# EAGLE design Test Bench (EAGLE 9.6.2)
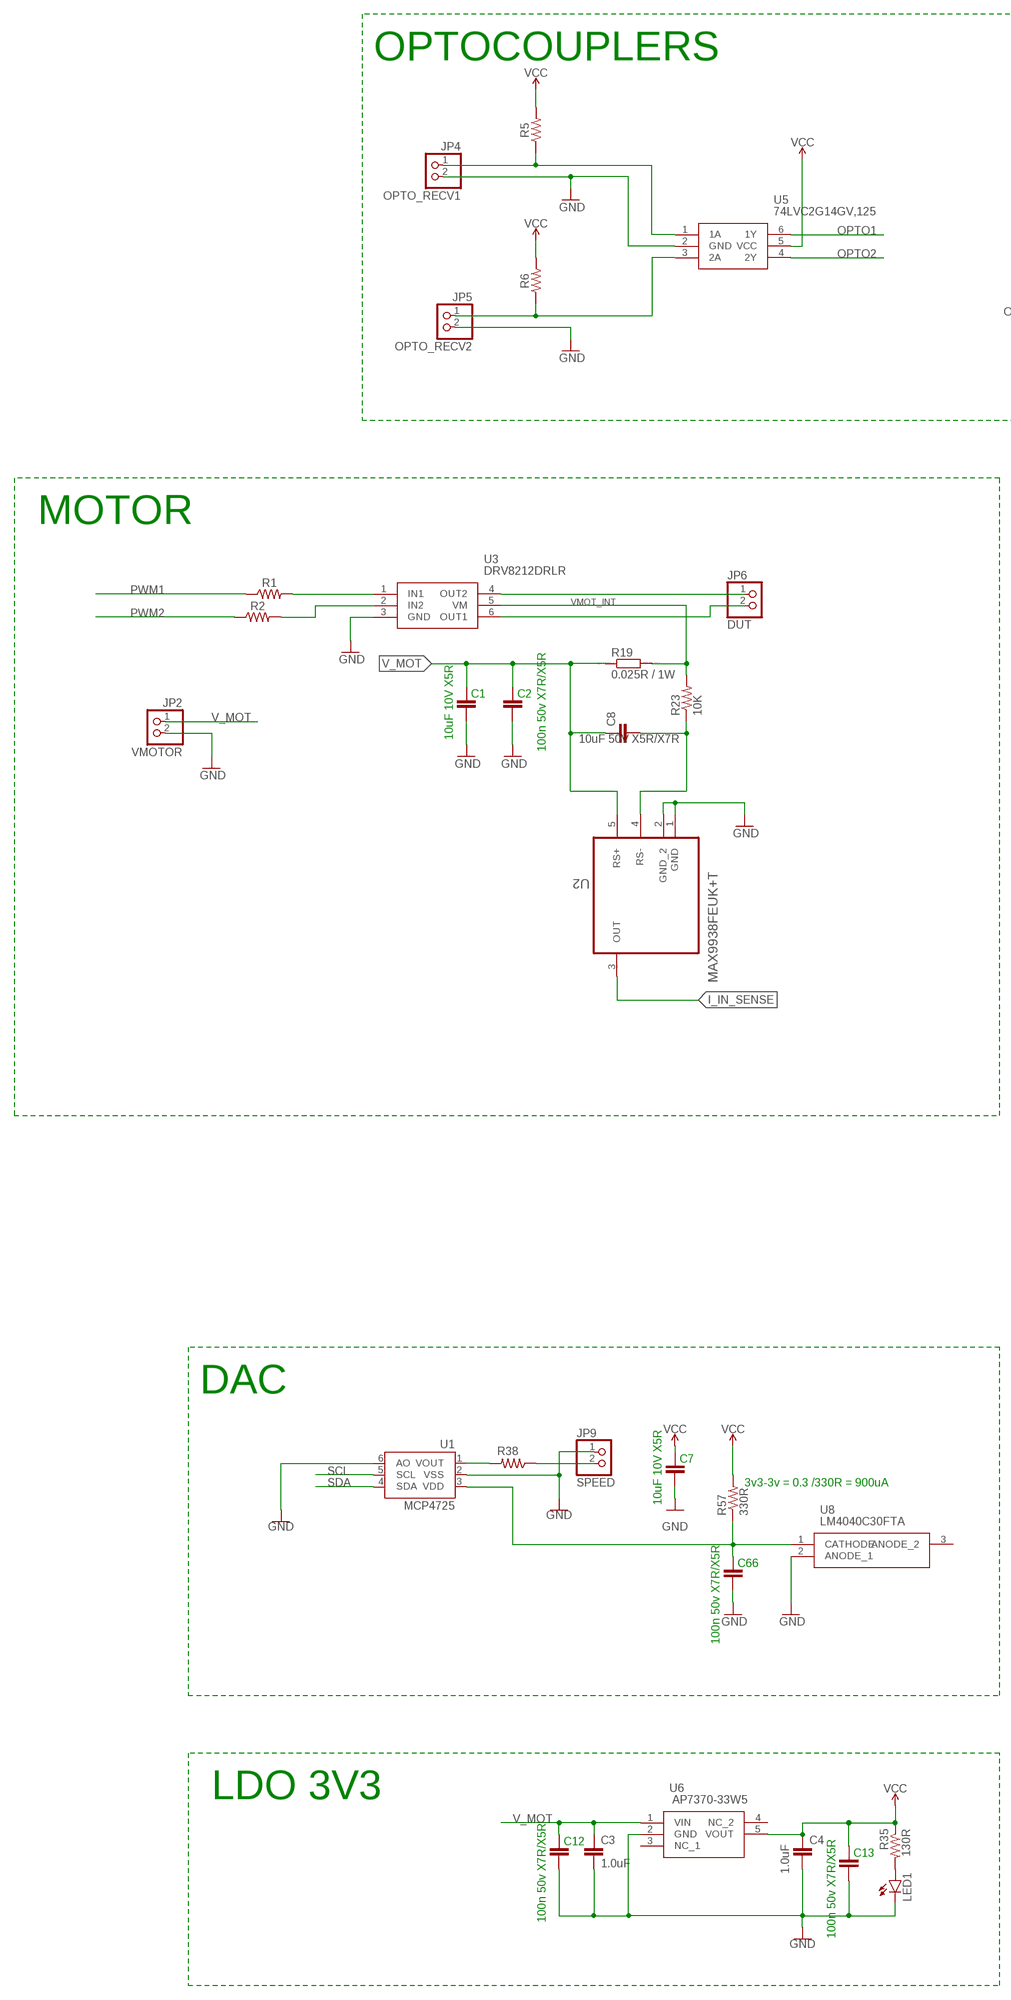
[diagram p0: schematic, sheet 1, part 1 of 2]
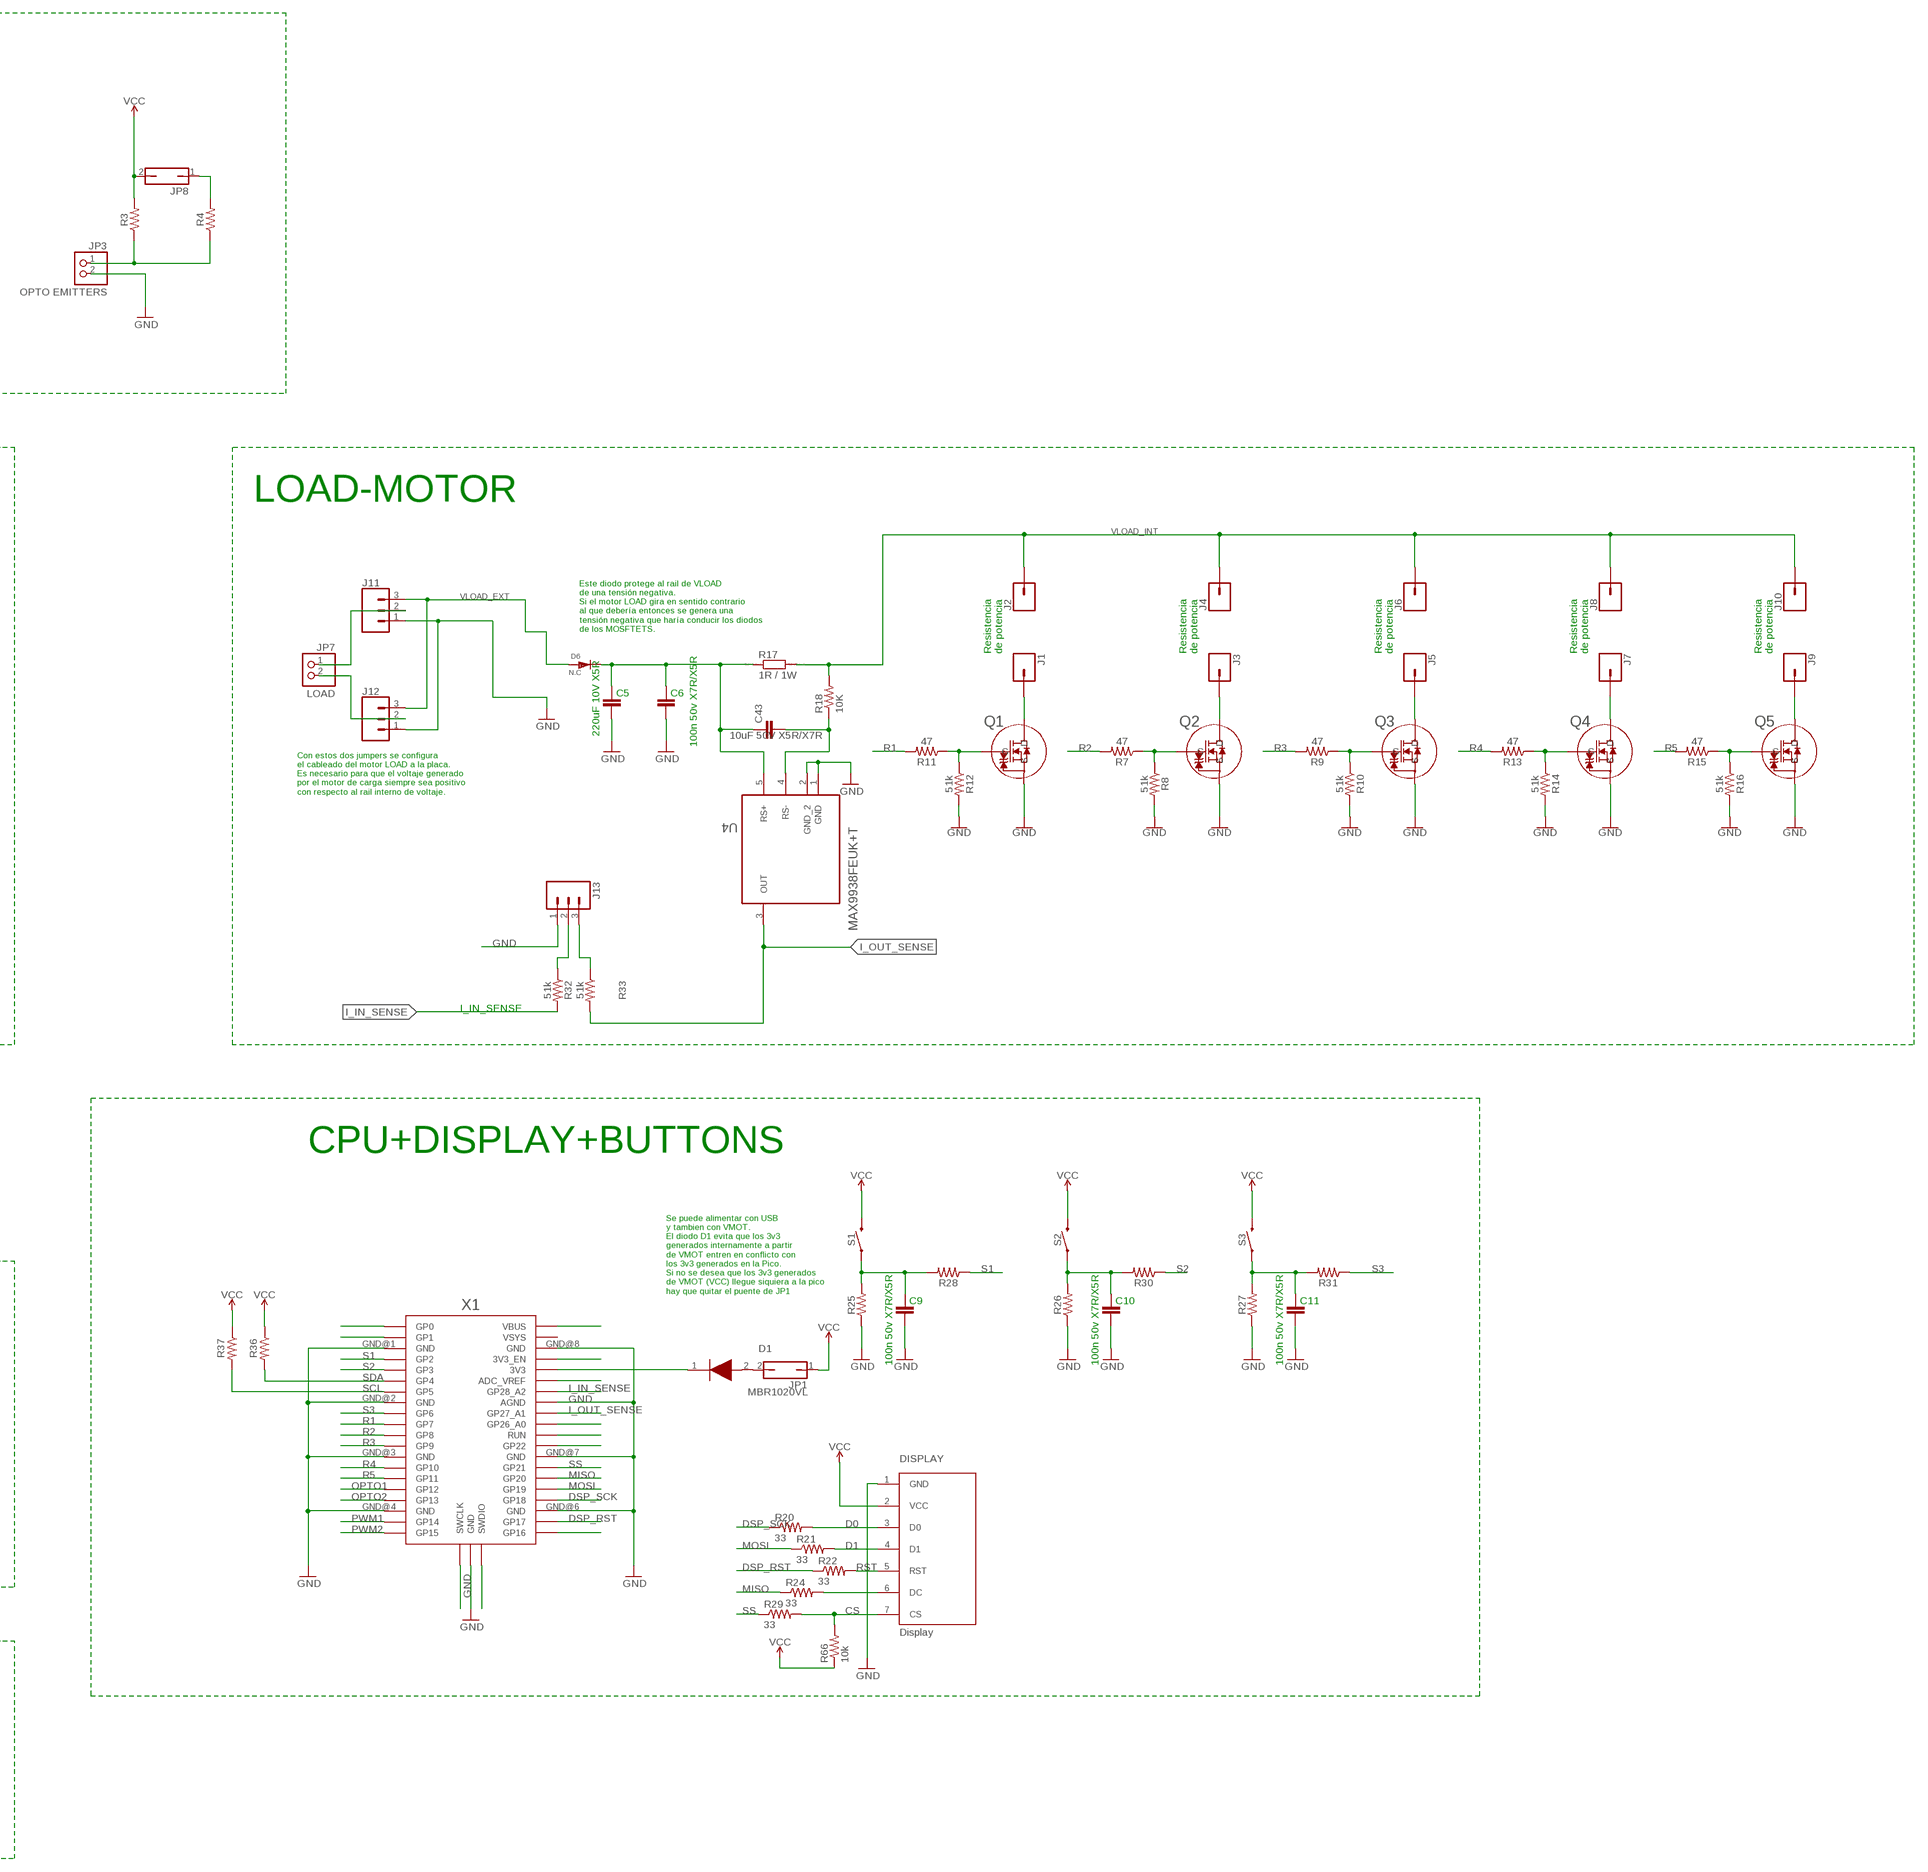
[diagram p1: schematic, sheet 1, part 2 of 2]

## Parts
C1  10uF 10V X5R  CAP0805  [0805]
C2  100n 50v X7R/X5R  CAP0805  [0805]
C3  1.0uF  1.0UF-0805-25V-(+80/-20%)  [0805]
C4  1.0uF  1.0UF-0805-25V-(+80/-20%)  [0805]
C5  220uF 10V X5R  CAP0805  [0805]
C6  100n 50v X7R/X5R  CAP0805  [0805]
C7  10uF 10V X5R  CAP0805  [0805]
C8  10uF 50V X5R/X7R  CAP1206  [1206]
C9  100n 50v X7R/X5R  CAP0805  [0805]
C10  100n 50v X7R/X5R  CAP0805  [0805]
C11  100n 50v X7R/X5R  CAP0805  [0805]
C12  100n 50v X7R/X5R  CAP0805  [0805]
C13  100n 50v X7R/X5R  CAP0805  [0805]
C43  10uF 50V X5R/X7R  CAP1206  [1206]
C66  100n 50v X7R/X5R  CAP0805  [0805]
D1  MBR1020VL  [SODFL3617X108N]
D6  N.C  DSMC  [DO-214AB]
DISPLAY  Display  OLED_LCD  [OLED_LCD]
J1  CONN_01  [1X01]
J2  CONN_01  [1X01]
J3  CONN_01  [1X01]
J4  CONN_01  [1X01]
J5  CONN_01  [1X01]
J6  CONN_01  [1X01]
J7  CONN_01  [1X01]
J8  CONN_01  [1X01]
J9  CONN_01  [1X01]
J10  CONN_01  [1X01]
J11  CONN_03  [1X03]
J12  CONN_03  [1X03]
J13  CONN_03  [1X03]
JP1  JP1Q  [JP1]
JP2  VMOTOR  PINHD-1X2  [1X02]
JP3  OPTO EMITTERS  PINHD-1X2  [1X02]
JP4  OPTO_RECV1  PINHD-1X2  [1X02]
JP5  OPTO_RECV2  PINHD-1X2  [1X02]
JP6  DUT  PINHD-1X2  [1X02]
JP7  LOAD  PINHD-1X2  [1X02]
JP8  JP1Q  [JP1]
JP9  SPEED  PINHD-1X2  [1X02]
LED1  LED3MM  [LED3MM]
Q1  PJA3416AE_R1_00001  [SOT23_PJA3416_PNJ]
Q2  PJA3416AE_R1_00001  [SOT23_PJA3416_PNJ]
Q3  PJA3416AE_R1_00001  [SOT23_PJA3416_PNJ]
Q4  PJA3416AE_R1_00001  [SOT23_PJA3416_PNJ]
Q5  PJA3416AE_R1_00001  [SOT23_PJA3416_PNJ]
R1  RESISTOR0805  [0805]
R2  RESISTOR0805  [0805]
R3  RESISTOR0805  [0805]
R4  RESISTOR0805  [0805]
R5  RESISTOR0805  [0805]
R6  RESISTOR0805  [0805]
R7  47  RESISTOR0805  [0805]
R8  51k  RESISTOR0805  [0805]
R9  47  RESISTOR0805  [0805]
R10  51k  RESISTOR0805  [0805]
R11  47  RESISTOR0805  [0805]
R12  51k  RESISTOR0805  [0805]
R13  47  RESISTOR0805  [0805]
R14  51k  RESISTOR0805  [0805]
R15  47  RESISTOR0805  [0805]
R16  51k  RESISTOR0805  [0805]
R17  1R / 1W  RR2512  [R2512]
R18  10K  RESISTOR0805  [0805]
R19  0.025R / 1W  RR2512  [R2512]
R20  33  RESISTOR0805  [0805]
R21  33  RESISTOR0805  [0805]
R22  33  RESISTOR0805  [0805]
R23  10K  RESISTOR0805  [0805]
R24  33  RESISTOR0805  [0805]
R25  RESISTOR0805  [0805]
R26  RESISTOR0805  [0805]
R27  RESISTOR0805  [0805]
R28  RESISTOR0805  [0805]
R29  33  RESISTOR0805  [0805]
R30  RESISTOR0805  [0805]
R31  RESISTOR0805  [0805]
R32  51k  RESISTOR0805  [0805]
R33  51k  RESISTOR0805  [0805]
R35  130R  RESISTOR0805  [0805]
R36  RESISTOR0805  [0805]
R37  RESISTOR0805  [0805]
R38  RESISTOR0805  [0805]
R57  330R  RESISTOR0805  [0805]
R66  10k  RESISTOR0805  [0805]
S1  MOMENTARY-SWITCH-SPST-SMD-5.2MM  [TACTILE_SWITCH_SMD_5.2MM]
S2  MOMENTARY-SWITCH-SPST-SMD-5.2MM  [TACTILE_SWITCH_SMD_5.2MM]
S3  MOMENTARY-SWITCH-SPST-SMD-5.2MM  [TACTILE_SWITCH_SMD_5.2MM]
U1  MCP4725  MCP4725SOT-23  [SOT23-6]
U2  MAX9938FEUK+T  [SOT95P280X145-5N]
U3  DRV8212DRLR  [SOTFL50P160X60-6N]
U4  MAX9938FEUK+T  [SOT95P280X145-5N]
U5  74LVC2G14GV,125  [SOT95P275X110-6N]
U6  AP7370-33W5  AP7370-50W5-7  [SOT95P285X140-5N]
U8  LM4040C30FTA  [SOT96P240X120-3N]
X1  RPI_PICO_IG-TH  [RPI_PICO_TH]

## Nets
3V_REF: C66.2 R57.1 U1.3(VDD) U8.1(CATHODE)
CS: DISPLAY.7(CS) R29.2 R66.2
D0: DISPLAY.3(D0) R20.2
D1: DISPLAY.4(D1) R21.2
DSP_RST: R22.1 X1.GP17
DSP_SCK: R20.1 X1.GP18
GND: C1.1 C2.1 C3.2 C4.2 C5.1 C6.1 C7.1 C9.1 C10.1 C11.1 C12.1 C13.1 C66.1 DISPLAY.1(GND) J11.1 J12.1 J13.1 JP2.2 JP3.2 JP4.2 JP5.2 JP9.1 LED1.K(C) Q1.2(S) Q2.2(S) Q3.2(S) Q4.2(S) Q5.2(S) R8.2 R10.2 R12.2 R14.2 R16.2 R25.1 R26.1 R27.1 U1.2(VSS) U1.6(AO) U2.1(GND) U2.2(GND_2) U3.3(GND) U4.1(GND) U4.2(GND_2) U5.2(GND) U6.2(GND) U8.2(ANODE_1) X1.AGND X1.GND@1(GND) X1.GND@2(GND) X1.GND@3(GND) X1.GND@4(GND) X1.GND@5(GND) X1.GND@6(GND) X1.GND@7(GND) X1.GND@8(GND)
I_IN_SENSE: R32.2 U2.3(OUT) X1.GP28_A2
I_OUT_SENSE: R33.2 U4.3(OUT) X1.GP27_A1
MISO: R24.1 X1.GP20
MOSI: R21.1 X1.GP19
N$1: J13.2 R32.1
N$2: JP3.1 R3.1 R4.1
N$3: J9.1 Q5.3(D)
N$4: JP8.1 R4.2
N$5: JP4.1 R5.1 U5.1(1A)
N$6: JP5.1 R6.1 U5.3(2A)
N$7: JP6.2 U3.6(OUT1)
N$8: R38.2 U1.1(VOUT)
N$9: J13.3 R33.1
N$10: JP6.1 U3.4(OUT2)
N$11: R1.2 U3.1(IN1)
N$12: R2.2 U3.2(IN2)
N$13: Q2.1(G) R7.1 R8.1
N$14: Q3.1(G) R9.1 R10.1
N$15: Q4.1(G) R13.1 R14.1
N$16: DISPLAY.6(DC) R24.2
N$17: Q5.1(G) R15.1 R16.1
N$18: JP9.2 R38.1
N$19: Q1.1(G) R11.1 R12.1
N$21: J11.2 JP7.1
N$22: D1.2(A) JP1.2
N$23: J12.2 JP7.2
N$24: J1.1 Q1.3(D)
N$25: J3.1 Q2.3(D)
N$26: J5.1 Q3.3(D)
N$27: J7.1 Q4.3(D)
N$29: C9.2 R25.2 R28.2 S1.1
N$30: C10.2 R26.2 R30.2 S2.1
N$31: X1.GP1
N$32: X1.GP0
N$33: X1.VBUS
N$34: C43.2 R18.1 U4.4(RS-)
N$35: X1.3V3_EN
N$36: D1.1(K) X1.3V3
N$37: X1.ADC_VREF
N$39: C8.2 R23.1 U2.4(RS-)
N$41: X1.GP26_A0
N$42: X1.RUN
N$43: X1.GP22
N$44: LED1.A R35.2
N$46: C11.2 R27.2 R31.2 S3.1
N$51: X1.GP16
N$52: X1.SWCLK
N$54: X1.SWDIO
OPTO1: U5.6(1Y) X1.GP12
OPTO2: U5.4(2Y) X1.GP13
PWM1: R1.1 X1.GP14
PWM2: R2.1 X1.GP15
R1: R11.2 X1.GP7
R2: R7.2 X1.GP8
R3: R9.2 X1.GP9
R4: R13.2 X1.GP10
R5: R15.2 X1.GP11
RST: DISPLAY.5(RST) R22.2
S1: R28.1 X1.GP2
S2: R30.1 X1.GP3
S3: R31.1 X1.GP6
SCL: R37.2 U1.5(SCL) X1.GP5
SDA: R36.2 U1.4(SDA) X1.GP4
SS: R29.1 X1.GP21
V_MOT: C1.2 C2.2 C3.1 C8.1 C12.2 JP2.1 R19.1 U2.5(RS+) U6.1(VIN)
VCC: C4.1 C7.2 C13.2 DISPLAY.2(VCC) JP1.1 JP8.2 R3.2 R5.2 R6.2 R35.1 R36.1 R37.1 R57.2 R66.1 S1.3 S2.3 S3.3 U5.5(VCC) U6.5(VOUT)
VLOAD_EXT: D6.1(A) J11.3 J12.3
VLOAD_INT: J2.1 J4.1 J6.1 J8.1 J10.1 R17.2 R18.2
VMOT_INT: R19.2 R23.2 U3.5(VM)
VOLAD_EXT2: C5.2 C6.2 C43.1 D6.2(K) R17.1 U4.5(RS+)
Unconnected: U6.3(NC_1) U6.4(NC_2) U8.3(ANODE_2) X1.VSYS

## Notes on the sheet
- OPTOCOUPLERS
- MOTOR | LOAD-MOTOR
- Este diodo protege al rail de VLOAD
  de una tensión negativa.
  Si el motor LOAD gira en sentido contrario
  al que debería entonces se genera una
  tensión negativa que haría conducir los diodos
  de los MOSFTETS.
- Resistencia
  de potencia
- Resistencia
  de potencia
- Resistencia
  de potencia
- Resistencia
  de potencia
- Resistencia
  de potencia
- Con estos dos jumpers se configura
  el cableado del motor LOAD a la placa.
  Es necesario para que el voltaje generado
  por el motor de carga siempre sea positivo
  con respecto al rail interno de voltaje.
- I_IN_SENSE
- CPU+DISPLAY+BUTTONS
- Se puede alimentar con USB
  y tambien con VMOT.
  El diodo D1 evita que los 3v3
  generados internamente a partir
  de VMOT entren en conflicto con
  los 3v3 generados en la Pico.
  Si no se desea que los 3v3 generados
  de VMOT (VCC) llegue siquiera a la pico
  hay que quitar el puente de JP1
- DAC
- 3v3-3v = 0.3 /330R = 900uA
- LDO 3V3

## Library data of the parts
C1 C2 C5-C13 C43 C66 = SparkFun-Passives:CAP: Capacitor Standard 0603 ceramic capacitor, and 0.1" leaded capacitor.
C3 C4 = SparkFun-Capacitors:1.0UF: 1µF ceramic capacitors A capacitor is a passive two-terminal electrical component used to store electrical energy temporarily in an electric field.; PROD_ID: CAP-11625
D1 = MBR1020VL:MBR1020VL: ON SEMICONDUCTOR - MBR1020VL - SCHOTTKY RECT, AEC-Q101, 20V, SOD123F Source: Datasheet <https://componentsearchengine.com/Datasheets/2/MBR1020VL.pdf>; ARROW_PART_NUMBER: MBR1020VL; ARROW_PRICE-STOCK: https://www.arrow.com/en/products/mbr1020vl/on-semiconductor; DESCRIPTION: ON SEMICONDUCTOR - MBR1020VL - SCHOTTKY RECT, AEC-Q101, 20V, SOD123F; HEIGHT: 1.08mm; MANUFACTURER_NAME: onsemi; MANUFACTURER_PART_NUMBER: MBR1020VL; MOUSER_PART_NUMBER: 512-MBR1020VL; MOUSER_PRICE-STOCK: https://www.mouser.co.uk/ProductDetail/onsemi-Fairchild/MBR1020VL?qs=tqW9UTzndZyBdyFrl3AmSw%3D%3D
D6 = EDCPSU - Rev3:D*
DISPLAY = EDCPSU:OLED_LCD
J1-J10 = SparkFun-Connectors:CONN_01: Single connection point. Often used as Generic Header-pin footprint for 0.1 inch spaced/style header connections On any of the 0.1 inch spaced packages, you can populate with these: Break Away Headers - Straight <https://www.sparkfun.com/products/116> (PRT-00116) Break Away Male Headers - Right Angle <https://www.sparkfun.com/products/553> (PRT-00553) Female Headers <https://www.sparkfun.com/products/115> (PRT-00115) Break Away Headers - Machine Pin <https://www.sparkfun.com/products/117> (PRT-00117) Break Away Female Headers - Swiss Machine Pin <https://www.sparkfun.com/products/743> (PRT-00743) This device is also useful as a general connection point to wire up your design to another part of your project. Our various solder wires solder well into these plated through hole pads. Hook-Up Wire - Assortment (Stranded, 22 AWG) <https://www.sparkfun.com/products/11375> (PRT-11375) Hook-Up Wire - Assortment (Solid Core, 22 AWG) <https://www.sparkfun.com/products/11367> (PRT-11367) View the entire wire category on our website here <https://www.sparkfun.com/categories/141> Special notes: SMTSO-256-ET is a "flush mount" nut for a 4-40 screw. We mostly use this on specialty testbeds; it is a nice way to connect hardware to your PCB at an adjustable hieght. Also note, the SNAP packages are for using a snappable style connector. We sell a baggie of snaps and they are also used on two LilyPad designs: Snap Assortment - 30 pack (male and female) <https://www.sparkfun.com/products/11347> (DEV-11347) LilyPad Arduino SimpleSnap <https://www.sparkfun.com/products/10941> (DEV-10941) LilyPad SimpleSnap Protoboard <https://www.sparkfun.com/products/10940> (DEV-10940)
J11-J13 = SparkFun-Connectors:CONN_03: Multi connection point. Often used as Generic Header-pin footprint for 0.1 inch spaced/style header connections On any of the 0.1 inch spaced packages, you can populate with these: Break Away Headers - Straight <https://www.sparkfun.com/products/116> (PRT-00116) Break Away Male Headers - Right Angle <https://www.sparkfun.com/products/553> (PRT-00553) Female Headers <https://www.sparkfun.com/products/115> (PRT-00115) Break Away Headers - Machine Pin <https://www.sparkfun.com/products/117> (PRT-00117) Break Away Female Headers - Swiss Machine Pin <https://www.sparkfun.com/products/743> (PRT-00743) Stackable Header - 3 Pin (Female, 0.1") <https://www.sparkfun.com/products/13875> (PRT-13875) For SCREWTERMINALS and SPRING TERMINALS visit here: Screw Terimnals on SparkFun.com <https://www.sparkfun.com/search/results?term=Screw+Terminals> (5mm/3.5mm/2.54mm spacing) This device is also useful as a general connection point to wire up your design to another part of your project. Our various solder wires solder well into these plated through hole pads. Hook-Up Wire - Assortment (Stranded, 22 AWG) <https://www.sparkfun.com/products/11375> (PRT-11375) Hook-Up Wire - Assortment (Solid Core, 22 AWG) <https://www.sparkfun.com/products/11367> (PRT-11367) View the entire wire category on our website here <https://www.sparkfun.com/categories/141> Special notes: Molex polarized connector foot print use with SKU : PRT-08232 with associated crimp pins and housings.
JP1 JP8 = jumper:JP1Q: JUMPER
JP2-JP7 JP9 = Connector:PINHD-1X2: PIN HEADER; CATEGORY: Headers; DESCRIPTION: Header, Straight, 2 Position; MANUFACTURER: Generic; MPN: Generic; OPERATING_TEMPERATURE: Generic; PART_STATUS: Active; PITCH: 0.100" (2.54mm); ROHS_COMPLIANCE: Generic; SERIES: Generic; SUB-CATEGORY: Headers, Male Pins; TYPE: Board to Board or Cable, Unshrouded, Through Hole, Straight
LED1 = SparkFun-LED:LED: LEDs Standard schematic elements and footprints for 5mm, 3mm, 1206, and 0603 sized LEDs. 5mm - Spark Fun Electronics SKU : COM-00529 (and others)
Q1-Q5 = PJA3416AE_R1_00001:PJA3416AE_R1_00001; COPYRIGHT: Copyright (C) 2022 Ultra Librarian. All rights reserved.; DIGI-KEY_PART_NUMBER_1: 3757-PJA3416AE_R1_00001TR-ND; DIGI-KEY_PART_NUMBER_2: 3757-PJA3416AE_R1_00001CT-ND; DIGI-KEY_PART_NUMBER_3: 3757-PJA3416AE_R1_00001DKR-ND; MANUFACTURER_PART_NUMBER: PJA3416AE_R1_00001; MFR_NAME: Panjit
R1-R16 R18 R20-R33 R35-R38 R57 R66 = SparkFun-Resistors:RESISTOR: Generic Resistor Package
R17 R19 = eagle-ltspice:R: RESISTOR, European symbol; SPICEMODEL: NONE; SPICEPREFIX: R
S1-S3 = SparkFun-Switches:MOMENTARY-SWITCH-SPST: Momentary Switch (Pushbutton) - SPST Normally-open (NO) SPST momentary switches (buttons, pushbuttons). Variants PTH-12MM - 12mm square, through-hole Momentary Pushbutton Switch - 12mm Square <https://www.sparkfun.com/products/9190> (COM-09190) PTH-6.0MM, PTH-6.0MM-KIT - 6.0mm square, through-hole Mini Pushbutton Switch <https://www.sparkfun.com/products/97> (COM-00097) KIT package intended for soldering kit's - only one side of pads' copper is exposed. PTH-RIGHT-ANGLE-KIT - Right-angle, through-hole Right Angle Tactile Button <https://www.sparkfun.com/products/10791> - Used on SparkFun BigTime Watch Kit <https://www.sparkfun.com/products/11734> SMD-12MM - 12mm square, surface-mount Tactile Button - SMD (12mm) <https://www.sparkfun.com/products/12993> (COM-12993) Used on SparkFun PicoBoard <https://www.sparkfun.com/products/11888> SMD-4.5MM - 4.5mm Square Trackball Switch Used on SparkFun Blackberry Trackballer Breakout <https://www.sparkfun.com/products/13169> SMD-4.6MMX2.8MM - 4.60mm x 2.80mm, surface mount Used on SparkFun SAMD21 Mini Breakout <https://www.sparkfun.com/products/13664> SMD-5.2MM, SMD-5.2-REDUNDANT - 5.2mm square, surface-mount Mini Pushbutton Switch - SMD <https://www.sparkfun.com/products/8720> (COM-08720) Used on Arduino Pro Mini <https://www.sparkfun.com/products/11114> REDUNDANT package connects both switch circuits together SMD-6.0X3.5MM - 6.0 x 3.5mm, surface mount Momentary Reset Switch SMD <https://www.sparkfun.com/products/8229> (COM-08229) SMD-6.2MM-TALL - 6.2mm square, surface mount Tactile Button - SMD (6mm) <https://www.sparkfun.com/products/12992> Used on SparkFun Digital Sandbox <https://www.sparkfun.com/products/12651> SMD-RIGHT-ANGLE - Right-angle, surface mount Used on SparkFun Block for Intel® Edison - Arduino <https://www.sparkfun.com/products/13036>; PROD_ID: SWCH-08247; SF_SKU: COM-08720
U1 = SparkFun-IC-Conversion:MCP4725: MCP4725 DAC Microchip 12-bit I2C DAC, SOT23-6 Datasheet <https://cdn.sparkfun.com/datasheets/BreakoutBoards/MCP4725_2009.pdf> SparkFun Products SparkFun I2C DAC Breakout - MCP4725 <https://www.sparkfun.com/products/12918> (BOB-12918); PROD_ID: IC-08886
U2 U4 = MAX9938:MAX9938FEUK+T; DESCRIPTION: Precision Current-Sense Amplifier; MPN: MAX9938FEUK+T; OC_FARNELL: -; OC_NEWARK: 01N6733; PACKAGE: SOT-23-5; SUPPLIER: Maxim
U3 = DRV8212DRLR:DRV8212DRLR: Motor / Motion / Ignition Controllers & Drivers 12-V, 2-A Low voltage H-bridge motor driver Source: Datasheet <https://www.ti.com/lit/ds/symlink/drv8212.pdf?ts=1631761675954&ref_url=https%3A%2F%2Fwww.ti.com%2Fstore%2Fti%2Fen%2Fp%2Fproduct%2F%3Fp%3DDRV8212DRLR%26keyMatch%3DDRV8212DRLR%26tisearch%3Dsearch-everything%26usecase%3DOPN>; ARROW_PART_NUMBER: DRV8212DRLR; ARROW_PRICE-STOCK: https://www.arrow.com/en/products/drv8212drlr/texas-instruments?region=nac; DESCRIPTION: Motor / Motion / Ignition Controllers & Drivers 12-V, 2-A Low voltage H-bridge motor driver; HEIGHT: 0.6mm; MANUFACTURER_NAME: Texas Instruments; MANUFACTURER_PART_NUMBER: DRV8212DRLR; MOUSER_PART_NUMBER: 595-DRV8212DRLR; MOUSER_PRICE-STOCK: https://www.mouser.co.uk/ProductDetail/Texas-Instruments/DRV8212DRLR?qs=7D1LtPJG0i3wtDTC%2FUQdKg%3D%3D
U5 = 74LVC2G14GV_125:74LVC2G14GV,125: 74LVC2G14 - Dual inverting Schmitt trigger with 5 V tolerant input@en-us Source: Datasheet <https://assets.nexperia.com/documents/data-sheet/74LVC2G14.pdf>; ARROW_PART_NUMBER: 74LVC2G14GV,125; ARROW_PRICE-STOCK: https://www.arrow.com/en/products/74lvc2g14gv125/nexperia?region=nac; DESCRIPTION: 74LVC2G14 - Dual inverting Schmitt trigger with 5 V tolerant input@en-us; HEIGHT: 1.1mm; MANUFACTURER_NAME: Nexperia; MANUFACTURER_PART_NUMBER: 74LVC2G14GV,125; MOUSER_PART_NUMBER: 771-LVC2G14GV125; MOUSER_PRICE-STOCK: https://www.mouser.co.uk/ProductDetail/Nexperia/74LVC2G14GV125?qs=me8TqzrmIYWSRNkZJZJAxg%3D%3D
U6 = AP7370-50W5-7:AP7370-50W5-7: LDO Voltage Regulators 300mA, 5V ULDO Regulator Source: Datasheet <https://componentsearchengine.com/Datasheets/1/AP7370-50W5-7.pdf>; ARROW_PART_NUMBER: AP7370-50W5-7; ARROW_PRICE-STOCK: https://www.arrow.com/en/products/ap7370-50w5-7/diodes-incorporated; DESCRIPTION: LDO Voltage Regulators 300mA, 5V ULDO Regulator; HEIGHT: 1.4mm; MANUFACTURER_NAME: Diodes Inc.; MANUFACTURER_PART_NUMBER: AP7370-50W5-7; MOUSER_PART_NUMBER: 621-AP7370-50W5-7; MOUSER_PRICE-STOCK: https://www.mouser.co.uk/ProductDetail/Diodes-Incorporated/AP7370-50W5-7?qs=PzGy0jfpSMtOcE264tR47A%3D%3D
U8 = LM4040C30FTA:LM4040C30FTA: Diodes Inc LM4040C30FTA, Shunt Precision Voltage Reference 2.5V, 0.5%, 3-Pin SOT-23 Source: Datasheet <https://www.mouser.com/datasheet/2/115/LM4040-2681.pdf>; ARROW_PART_NUMBER: LM4040C30FTA; ARROW_PRICE-STOCK: https://www.arrow.com/en/products/lm4040c30fta/diodes-incorporated?region=nac; DESCRIPTION: Diodes Inc LM4040C30FTA, Shunt Precision Voltage Reference 2.5V, 0.5%, 3-Pin SOT-23; HEIGHT: 1.2mm; MANUFACTURER_NAME: Diodes Inc.; MANUFACTURER_PART_NUMBER: LM4040C30FTA; MOUSER_PART_NUMBER: 621-LM4040C30FTA; MOUSER_PRICE-STOCK: https://www.mouser.co.uk/ProductDetail/Diodes-Incorporated/LM4040C30FTA?qs=oUsD4qhOtFxJawR8QeoshQ%3D%3D
X1 = RaspberryPi_Pico:RPI_PICO_IG

## Board
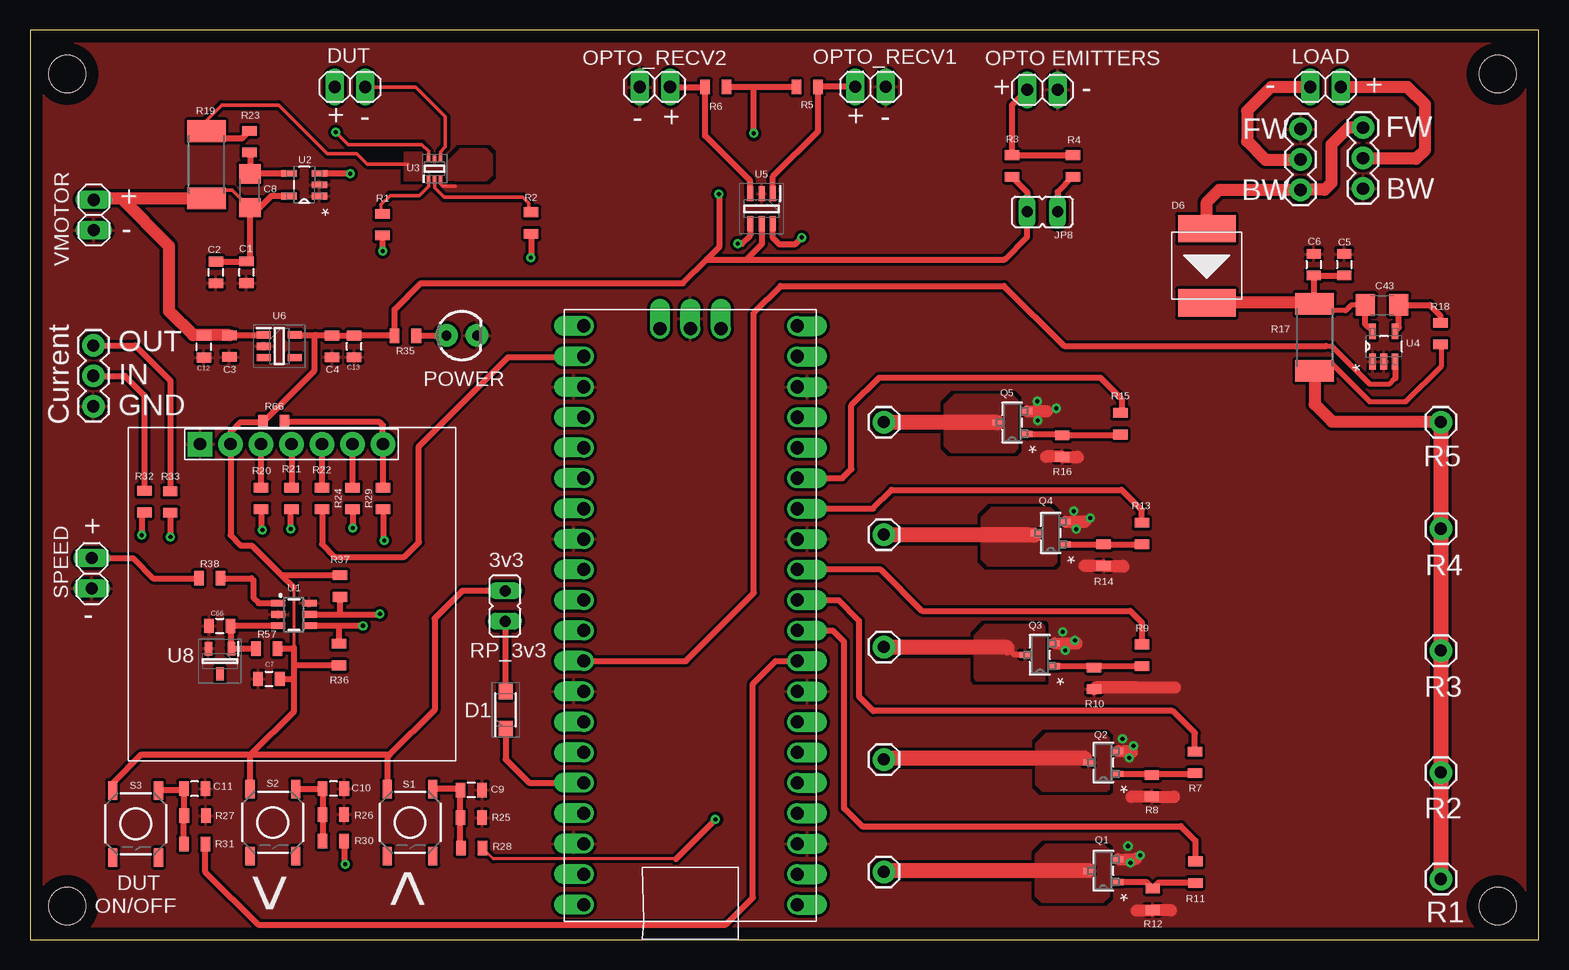
[diagram p2: board, top side]
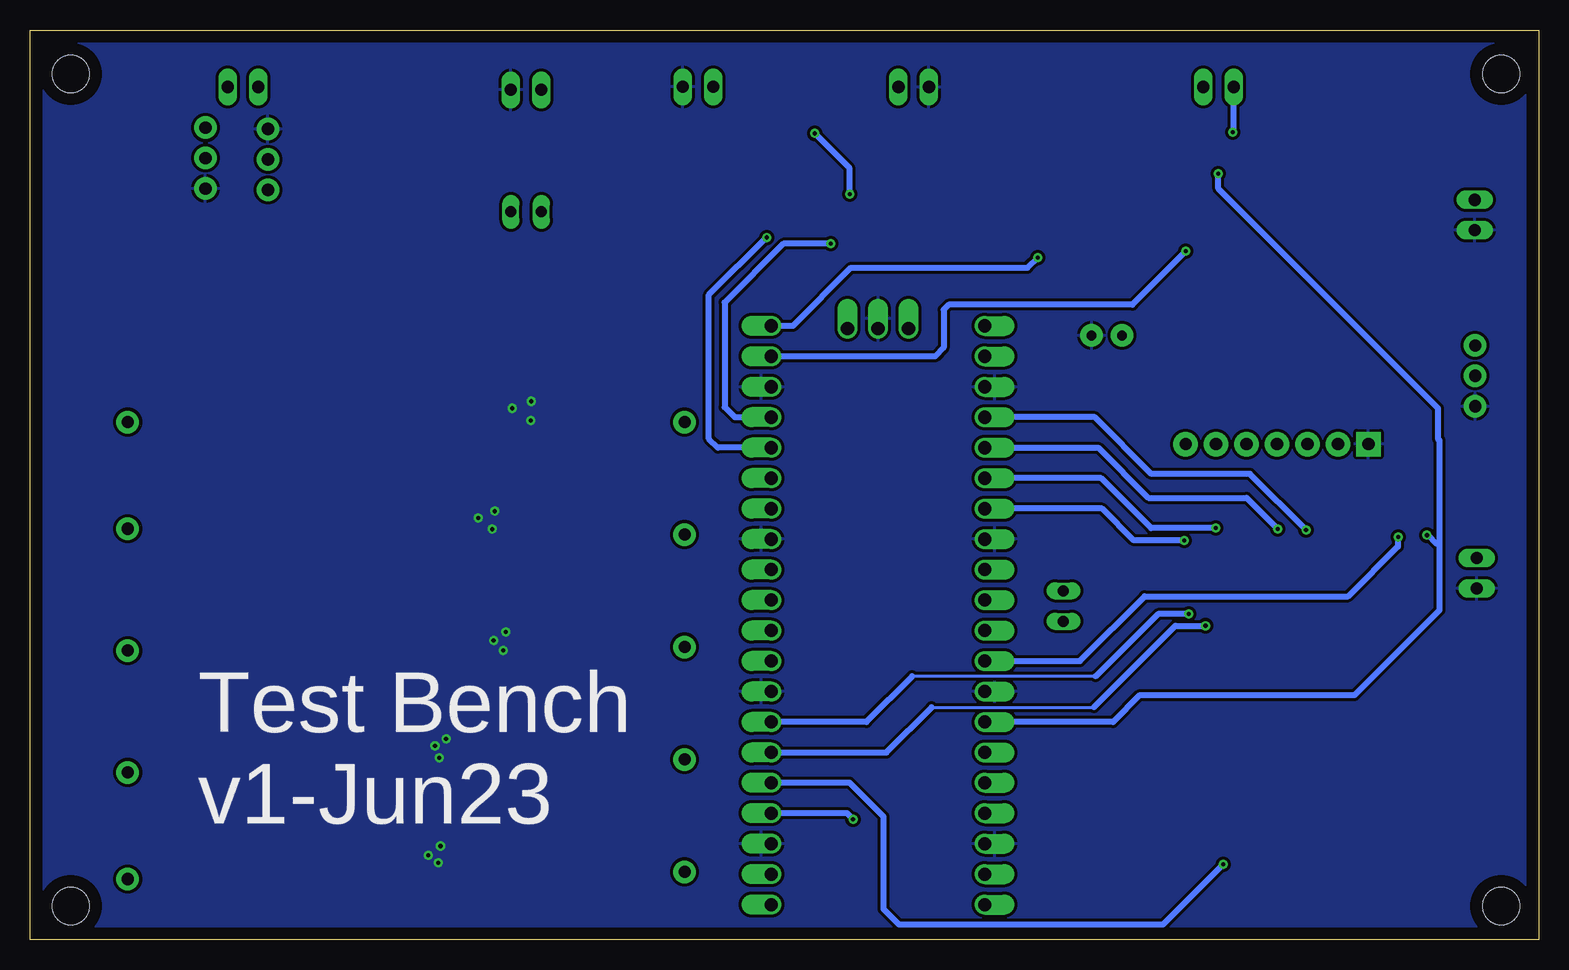
[diagram p3: board, bottom side, seen from below]

Size 125.71 x 75.87 mm. Coordinates in mm from the lower left corner, seen from the top.
Outline: 0,0 125.71,0 125.71,75.87 0,75.87 0,0
Copper layers (1*16): Top 0.035mm / dielectric 1.5mm / Bottom 0.035mm
Design rules "default": minimum track width 6mil, minimum drill 0.35mm, track to track 6mil, track to pad 6mil, pad to pad 6mil, via to via 6mil, smd to smd 6mil, copper to edge 40mil, drill to drill 6mil, minimum pad ring 10mil, minimum via ring 8mil, stop-mask expansion 4mil, vias tented up to drill 0mil, thermal gap 10mil
Holes 3.1 mm at 3.11,72.2 3.11,2.83 122.31,72.2 122.31,2.83

### Footprints (pad centres in the part's own frame; a part is rotated, then mirrored left to right if it is on the bottom)
0805 = smd 0.8 x 1.2: 1 -0.9,0; 2 0.9,0
1206 = smd 1.6 x 1.8: 1 -1.4,0; 2 1.4,0
SODFL3617X108N = smd 1.26 x 1.17: 1 -1.525,0; 2 1.525,0
DO-214AB = smd 2.286 x 4.8: 1 -3.1,0; 2 3.1,0
OLED_LCD = drill 1.016 pad 2.032 square: 1 -7.42,13.7 | drill 1.016 pad 2.032: 2 -4.88,13.7; 3 -2.34,13.7; 4 0.2,13.7; 5 2.74,13.7; 6 5.28,13.7; 7 7.82,13.7
1X01 = drill 1.016 pad 1.88: 1 0,0
1X03 = drill 1.016 pad 1.88: 1 0,0; 2 2.54,0; 3 5.08,0
JP1 = drill 0.914 long: 1 0,-1.27; 2 0,1.27
1X02 = drill 1.016 long: 1 -1.27,0; 2 1.27,0
LED3MM = drill 0.813 pad 1.88: A -1.27,0; K 1.27,0
SOT23_PJA3416_PNJ = smd 0.864 x 0.508: 1 -1.232,0.95; 2 -1.232,-0.95; 3 1.232,0
R2512 = smd 1.8 x 3.2: 1 -2.8,0; 2 2.8,0
TACTILE_SWITCH_SMD_5.2MM = smd 1.524 x 0.762: 1 -2.794,1.905; 2 2.794,1.905; 3 -2.794,-1.905; 4 2.794,-1.905
SOT23-6 = smd 0.55 x 1.2: 1 0.95,1.3; 2 0,1.3; 3 -0.95,1.3; 4 -0.95,-1.3; 5 0,-1.3; 6 0.95,-1.3
SOT95P280X145-5N = smd 1.321 x 0.559: 1 -1.27,0.94; 2 -1.27,0; 3 -1.27,-0.94; 4 1.27,-0.94; 5 1.27,0.94
SOTFL50P160X60-6N = smd 0.475 x 0.3: 1 -0.838,0.5; 2 -0.838,0; 3 -0.838,-0.5; 4 0.838,-0.5; 5 0.838,0; 6 0.838,0.5
SOT95P275X110-6N = smd 1.25 x 0.5: 1 -1.25,0.95; 2 -1.25,0; 3 -1.25,-0.95; 4 1.25,-0.95; 5 1.25,0; 6 1.25,0.95
SOT95P285X140-5N = smd 1.15 x 0.6: 1 -1.3,0.95; 2 -1.3,0; 3 -1.3,-0.95; 4 1.3,-0.95; 5 1.3,0.95
SOT96P240X120-3N = smd 1.1 x 0.65: 1 -1.05,0.96; 2 -1.05,-0.96; 3 1.05,0
RPI_PICO_TH = drill 1.1 pad 1.6 offset: 3V3 8.89,13.97; 3V3_EN 8.89,16.51; ADC_VREF 8.89,11.43; AGND 8.89,6.35; GND@1 -8.89,19.05; GND@2 -8.89,6.35; GND@3 -8.89,-6.35; GND@4 -8.89,-19.05; GND@5 0,-23.9; GND@6 8.89,-19.05; GND@7 8.89,-6.35; GND@8 8.89,19.05; GP0 -8.89,24.13; GP1 -8.89,21.59; GP2 -8.89,16.51; GP3 -8.89,13.97; GP4 -8.89,11.43; GP5 -8.89,8.89; GP6 -8.89,3.81; GP7 -8.89,1.27; GP8 -8.89,-1.27; GP9 -8.89,-3.81; GP10 -8.89,-8.89; GP11 -8.89,-11.43; GP12 -8.89,-13.97; GP13 -8.89,-16.51; GP14 -8.89,-21.59; GP15 -8.89,-24.13; GP16 8.89,-24.13; GP17 8.89,-21.59; GP18 8.89,-16.51; GP19 8.89,-13.97; GP20 8.89,-11.43; GP21 8.89,-8.89; GP22 8.89,-3.81; GP26_A0 8.89,1.27; GP27_A1 8.89,3.81; GP28_A2 8.89,8.89; RUN 8.89,-1.27; SWCLK -2.54,-23.9; SWDIO 2.54,-23.9; VBUS 8.89,24.13; VSYS 8.89,21.59

### Placement (x,y rotation side)
C1  18.04,55.67 90 top
C2  15.49,55.66 90 top
C3  16.62,49.52 270 top
C4  25.18,49.49 270 top
C5  109.52,56.3 270 top
C6  106.98,56.3 270 top
C7  19.91,21.77 0 top
C8  18.32,62.47 90 top
C9  36.77,12.5 180 top
C10  25.29,12.62 180 top
C11  13.72,12.61 180 top
C12  14.49,49.46 90 top
C13  27.01,49.49 90 top
C43  112.67,52.94 0 top
C66  15.82,26.18 0 top
D1  39.63,19.18 90 top
D6  98.07,56.21 270 top
DISPLAY  21.59,27.64 0 top
J1  71.16,5.68 0 top
J2  117.57,43.18 180 top
J3  71.16,15.05 0 top
J4  117.57,34.29 0 top
J5  71.16,24.43 0 top
J6  117.57,24.13 0 top
J7  71.16,33.81 0 top
J8  117.57,13.97 0 top
J9  71.16,43.18 180 top
J10  117.57,5.08 0 top
J11  105.88,67.62 270 top
J12  111.09,62.65 90 top
J13  5.28,44.49 90 top
JP1  39.59,27.84 180 top
JP2  5.32,60.44 270 top
JP3  84.37,70.88 0 top
JP4  70.04,71.13 0 top
JP5  52.07,71.12 180 top
JP6  26.67,71.12 180 top
JP7  107.95,71.12 0 top
JP8  84.37,60.72 90 top
JP9  5.15,30.57 90 top
LED1  35.98,50.4 0 top
Q1  89.45,5.78 180 top
Q2  89.45,14.8 180 top
Q3  84.15,23.78 180 top
Q4  85.05,33.93 180 top
Q5  81.84,43.14 180 top
R1  29.37,59.64 90 top
R2  41.76,59.78 90 top
R3  81.83,64.53 270 top
R4  86.91,64.53 270 top
R5  64.77,71.12 180 top
R6  57.15,71.12 0 top
R7  97.07,14.8 90 top
R8  93.48,12.84 270 top
R9  92.65,23.74 90 top
R10  88.67,21.82 270 top
R11  97.11,5.66 90 top
R12  93.56,3.4 270 top
R13  92.65,33.88 90 top
R14  89.46,32.09 270 top
R15  90.87,43.04 90 top
R16  86.02,41.18 270 top
R17  107.05,50.24 270 top
R18  117.54,50.56 270 top
R19  14.71,64.63 90 top
R20  19.26,36.82 90 top
R21  21.8,36.82 90 top
R22  24.34,36.82 90 top
R23  18.3,66.56 90 top
R24  26.88,36.82 90 top
R25  36.77,10.19 180 top
R26  25.27,10.46 180 top
R27  13.75,10.36 180 top
R28  36.8,7.67 180 top
R29  29.42,36.82 90 top
R30  25.28,8.23 180 top
R31  13.72,8 180 top
R32  9.54,36.54 270 top
R33  11.69,36.51 270 top
R35  31.29,50.37 0 top
R36  25.76,23.79 90 top
R37  25.84,29.5 270 top
R38  14.97,30.16 0 top
R57  19.74,24.29 0 top
R66  20.32,43.18 0 top
S1  31.67,9.79 270 top
S2  20.24,9.79 270 top
S3  8.8,9.67 270 top
U1  21.99,27.14 90 top
U2  22.85,62.96 180 top
U3  33.71,64.31 90 top
U4  112.82,49.48 90 top
U5  60.96,60.96 270 top
U6  20.77,49.5 0 top
U8  15.83,23.24 270 top
X1  55.04,27.07 180 top

### Tracks (layer width: path | path; a pad name or v marks a point on that pad's centre or on a via)
3V_REF
  Top 0.508: U1.3 C66.2 16.72,24.36 U8.1 R57.1
CS
  Top 0.508: R29.2 DISPLAY.7 29.41,42.91 29.14,43.18 R66.2
D0
  Top 0.508: R20.2 DISPLAY.3
D1
  Top 0.508: DISPLAY.4 R21.2
DSP_RST
  Top 0.508: X1.GP17 46.06,48.57 39.83,48.57 32.41,41.15 32.41,33.16 31.2,31.95 25.39,31.95 24.34,33 R22.1
DSP_SCK  (via drill 0.35)
  Top 0.508: R20.1 19.26,34.3 v19.37,34.19
  Bottom 0.508: v19.37,34.19 24.05,38.87 32.26,38.87 36.97,43.58 X1.GP18
GND  (via drill 0.35)
  Top 0.305: U3.3 34.21,63.02 34.4,62.83 35.42,62.83
  Top 1.016: Q5.2 84.74,44.09 84.75,44.08 | Q4.2 87.89,34.88 87.91,34.86 | Q3.2 87.19,24.73 87.21,24.71 | Q2.2 91.77,15.75 91.84,15.68 | Q1.2 92.11,6.73 92.18,6.8 | 95.1,2.46 95.06,2.5 R12.2 93.51,2.45 92.19,2.45 | 95.34,11.93 95.33,11.94 R8.2 91.8,11.94 91.79,11.93 | 95.43,21.03 88.78,21.03 R10.2 88.8,21.05 92.23,21.05 | 91.14,31.14 91.09,31.19 R14.2 87.86,31.19 | 87.34,40.24 87.3,40.28 R16.2 86,40.3 84.66,40.3
  other vias: 91.5,7.83 83.93,44.91 85.52,44.33 83.97,43.32 86.99,35.75 88.36,35.19 87.18,34.25 86.07,25.69 86.28,24.13 87.08,24.97 91.04,16.76 91.96,16.18 91.6,15.19 92.52,7.06 91.7,6.44
  pour Top (isolate 0.254, rank 2): -0.94,81.72 129.54,81.72 129.54,-3.73 -2.7,-3.73
  pour Bottom (isolate 0.254): -4.09,81.97 129.37,81.97 129.37,-4.75 -4.09,-4.75
I_IN_SENSE  (via drill 0.35)
  Top 0.152: R32.2 9.33,35.43
  Top 0.508: 9.33,35.43 9.33,33.78 v9.3,33.75 | v26.68,63.88 24.14,63.88 U2.3
  Bottom 0.508: 8.26,33.05 8.26,41.65 8.39,41.78 8.39,44.34 26.68,62.63 v26.68,63.88 | 8.26,33.05 8.26,27.49 15.33,20.42 33.22,20.42 35.46,18.18 X1.GP28_A2 | v9.3,33.75 9.21,33.75 8.51,33.05 8.26,33.05
I_OUT_SENSE  (via drill 0.35)
  Top 0.406: 108,49.52 108.48,49.52 111.64,46.36 113.3,46.36 113.78,46.84
  Top 0.508: X1.GP27_A1 54.65,23.26 60.33,28.94 60.33,52.3 62.56,54.53 81.16,54.53 86.17,49.52 108,49.52 | U4.3 113.78,48.19 113.78,46.84 | v11.7,33.6 11.67,33.63 11.67,35.59 R33.2
  Bottom 0.508: X1.GP27_A1 38.22,23.26 32.83,28.65 15.87,28.65 11.72,32.8 11.72,33.58 v11.7,33.6
MISO  (via drill 0.35)
  Top 0.508: R24.1 26.88,34.36 v26.9,34.34
  Bottom 0.508: v26.9,34.34 32.28,34.34 36.44,38.5 X1.GP20
MOSI  (via drill 0.35)
  Top 0.508: v21.74,34.27 21.74,35.86 R21.1
  Bottom 0.508: X1.GP19 36.7,41.04 32.51,36.85 24.32,36.85 v21.74,34.27
N$1
  Top 0.508: J13.2 7.91,47.03 9.54,45.4 R32.1
N$2
  Top 0.508: JP3.1 81.83,69.61 R3.1 R4.1
N$3
  Top 0.508: J9.1 71.2,43.14
  Top 1.27: Q5.3 71.2,43.14
  pour Top: 82.33,45 82.33,40.96 81.96,40.59 76.78,40.59 76.2,41.17 76.2,44.65 77.07,45.52 81.81,45.52
N$4
  Top 0.508: R4.2 85.64,62.36 JP8.1
N$5
  Top 0.508: U5.1 61.91,63.67 65.67,67.43 R5.1 JP4.1
N$6
  Top 0.508: JP5.1 R6.1 56.25,67.05 60.01,63.29 U5.3
N$7  (via drill 0.35)
  Top 0.305: v25.47,67.35 26.51,66.31 32.66,66.31 33.21,65.76 U3.6
  Bottom 0.508: JP6.2 25.46,71.06 v25.46,67.36 v25.47,67.35
N$8
  Top 0.508: R38.2 18.44,30.16 18.62,29.98 18.62,28.52 19.05,28.09 U1.1
N$9
  Top 0.508: J13.3 8.75,49.57 11.69,46.63 R33.1
N$10
  Top 0.305: U3.4 34.21,65.73 34.62,66.14 34.62,68.63 32.13,71.12 JP6.1
N$11
  Top 0.254: 29.24,61.29 29.24,60.67 R1.2
  Top 0.305: U3.1 33.21,62.85 32.42,62.06 30.01,62.06 29.24,61.29
N$12
  Top 0.254: R2.2 41.55,60.89
  Top 0.305: U3.2 33.71,62.73 34.52,61.92 41.08,61.92 41.55,61.45 41.55,60.89
N$13
  Top 0.508: Q2.1 93.37,13.85 | 93.37,13.85 97.02,13.85 R7.1 | R8.1 93.37,13.85
N$14
  Top 0.508: Q3.1 88.56,22.83 R10.1 88.79,22.84 R9.1
N$15
  Top 0.508: Q4.1 86.29,32.99 R14.1 R13.1
N$16
  Top 0.508: DISPLAY.6 R24.2
N$17
  Top 0.508: Q5.1 83.11,42.14 85.96,42.14 R16.1 90.8,42.07 R15.1
N$18
  Top 0.508: JP9.2 8.59,31.84 10.27,30.16 R38.1
N$19
  Top 0.508: R11.1 97.07,4.8 94.06,4.8 R12.1 93.03,4.83 Q1.1
N$21
  Top 1.016: JP7.1 103.4,71.12 101.42,69.14 101.42,66.58 102.95,65.05 105.85,65.05 J11.2
N$22
  Top 0.508: JP1.2 39.59,20.75 D1.2
N$23
  Top 1.016: JP7.2 114.78,71.12 116.25,69.65 116.25,65.87 115.51,65.13 111.15,65.13 J12.2
N$24
  Top 0.508: J1.1 71.26,5.78
  Top 1.27: Q1.3 71.26,5.78
  pour Top: 89.92,7.53 89.92,3.61 89.39,3.08 84.36,3.08 83.78,3.66 83.78,7.14 84.65,8.01 89.44,8.01
N$25
  Top 0.508: 87.86,15.16 Q2.3 | 71.26,15.16 J3.1
  Top 1.27: 87.86,15.16 71.26,15.16
  pour Top: 89.93,16.86 89.93,12.57 89.7,12.34 84.41,12.34 83.83,12.92 83.83,16.4 84.7,17.27 89.52,17.27
N$26
  Top 0.508: Q3.3 82.03,23.78 81.42,24.39 | J5.1 71.2,24.39
  Top 1.27: 81.42,24.39 71.2,24.39
  pour Top: 78.63,25.36 78.63,21.85 78.87,21.61 84.58,21.61 84.61,21.64 84.61,26.11 84.43,26.29 79.57,26.29 78.68,25.4
N$27
  Top 0.508: 83.65,33.77 Q4.3 | J7.1 71.2,33.77
  Top 1.27: 83.65,33.77 71.2,33.77
  pour Top: 85.56,35.54 85.56,31.49 85.23,31.16 79.87,31.16 79.29,31.74 79.29,35.22 80.16,36.09 85.01,36.09
N$29
  Top 0.508: R28.2 35.87,7.7 R25.2 C9.2 35.79,12.58 S1.1
N$30
  Top 0.508: S2.1 22.18,12.62 C10.2 24.39,10.48 R26.2 R30.2
N$34
  Top 0.508: U4.4 114.07,51.06 C43.2 116.65,52.94 117.54,52.05 R18.1
N$36
  Top 0.508: D1.1 39.63,15.06 41.59,13.1 X1.3V3
N$39
  Top 0.508: C8.2 18.35,63.9 | U2.4 18.67,63.89 18.35,63.57 18.35,63.9 | R23.1 18.35,65.61 18.35,63.9
N$44
  Top 0.508: LED1.A 34.68,50.37 R35.2
N$46
  Top 0.508: R31.2 12.82,10.33 R27.2 12.85,12.58 C11.2 12.67,12.46 S3.1
OPTO1  (via drill 0.35)
  Top 0.508: v64.31,58.57 63.72,57.98 62.47,57.98 61.91,58.54 U5.6
  Bottom 0.508: X1.GP12 68.39,41.04 69.13,41.78 69.13,53.79 64.33,58.59 v64.31,58.57
OPTO2  (via drill 0.35)
  Top 0.508: U5.4 60.01,58.73 59.33,58.05 v58.99,58.05
  Bottom 0.508: v58.99,58.05 62.93,58.05 67.82,53.16 67.82,44.43 66.97,43.58 X1.GP13
PWM1  (via drill 0.35)
  Top 0.508: R1.1 29.37,57.45 v29.39,57.43
  Bottom 0.508: v29.39,57.43 33.85,52.97 49.15,52.97 49.57,52.55 49.57,49.38 50.29,48.66 X1.GP14
PWM2  (via drill 0.35)
  Top 0.508: R2.1 41.76,56.91 v41.74,56.89
  Bottom 0.508: v41.74,56.89 42.59,56.04 57.3,56.04 62.14,51.2 X1.GP15
R1
  Top 0.508: R11.2 97.11,8.28 95.91,9.48 69.34,9.48 67.85,10.97 67.85,24.85 66.9,25.8 X1.GP7
R2
  Top 0.508: R7.2 97.07,17.25 95.24,19.08 70.29,19.08 69.08,20.29 69.08,26.62 67.36,28.34 X1.GP8
R3
  Top 0.508: R9.2 92.65,26.47 91.68,27.44 74.32,27.44 70.88,30.88 X1.GP9
R4
  Top 0.508: R13.2 92.65,35.85 90.97,37.53 71.81,37.53 70.24,35.96 X1.GP10
R5
  Top 0.508: R15.2 90.97,44.04 90.97,45.1 89.19,46.88 70.75,46.88 68.45,44.58 68.45,39.25 67.7,38.5 X1.GP11
RST
  Top 0.508: DISPLAY.5 R22.2
S1  (via drill 0.35)
  Top 0.254: 53.85,6.76 38.61,6.76 R28.1
  Top 0.508: 53.85,6.76 57.12,10.03 v57.12,10.06
  Bottom 0.508: v57.12,10.06 57.62,10.56 X1.GP2
S2  (via drill 0.35)
  Top 0.508: R30.1 26.18,6.39 v26.27,6.3
  Bottom 0.508: v26.27,6.3 31.3,1.27 53.28,1.27 54.58,2.57 54.58,10.27 57.41,13.1 X1.GP3
S3
  Top 0.508: X1.GP6 62.14,23.26 60.24,21.36 60.24,3.52 57.99,1.27 19,1.27 14.62,5.65 R31.1
SCL  (via drill 0.35)
  Top 0.508: U1.5 25.82,27.14 | 25.82,27.14 29.12,27.14 v29.16,27.18 | R37.2 25.82,28.58 25.82,27.14
  Bottom 0.254: 36.9,21.99 52.2,21.99
  Bottom 0.508: v29.16,27.18 31.71,27.18 36.9,21.99 | 52.2,21.99 56.01,18.18 X1.GP5
SDA  (via drill 0.35)
  Top 0.508: v27.75,26.2 25.75,26.2 | 25.75,26.2 U1.4 | R36.2 25.75,26.2
  Bottom 0.254: 50.57,19.41 37.06,19.41
  Bottom 0.508: X1.GP4 54.34,15.64 50.57,19.41 | v27.75,26.2 30.27,26.2 37.06,19.41
SS  (via drill 0.35)
  Top 0.508: R29.1 29.42,33.41 v29.52,33.31
  Bottom 0.508: v29.52,33.31 33.72,33.31 36.37,35.96 X1.GP21
V_MOT
  Top 0.152: 16,62.53 15.95,62.48 15.36,62.48 R19.1
  Top 0.305: C8.1 16.86,62.53 16,62.53
  Top 0.508: U6.1 19.44,50.42 C3.1 14.55,50.42 C12.2 | 5.44,61.83 JP2.1 | C2.2 C1.2 18.3,56.83 18.3,61.05 C8.1 18.61,60.78 18.86,60.78 20.1,62.02 U2.5
  Top 1.016: C3.1 13.59,50.42 11.58,52.43 11.58,57.89 7.64,61.83 | 5.44,61.83 7.64,61.83 | 7.64,61.83 R19.1
VCC  (via drill 0.35)
  Top 0.254: 22.01,24.36 22.01,29.38
  Top 0.508: R5.2 60.34,71.12 | 60.34,71.12 R6.2 | R3.2 83.1,62.36 JP8.2 83.1,58.63 81.21,56.74 59.7,56.74 | U6.5 23.79,50.45 | 23.79,50.45 25.12,50.45 C4.1 C13.2 30.37,50.39 R35.1 30.39,52.57 32.57,54.75 54.4,54.75 56.39,56.74 | 23.79,50.45 23.68,50.34 23.68,47.44 R66.1 17.54,43.18 16.71,42.35 DISPLAY.2 16.71,33.73 17.57,32.87 18.52,32.87 20.99,30.4 | 22.01,29.38 20.99,30.4 | S2.3 18.34,15.45 | 22.01,21.76 22.01,19.05 18.41,15.45 | 22.01,21.76 22.01,22.91 | 22.01,22.91 22.01,24.36 21.94,24.29 R57.2 | S3.3 6.9,13.08 9.28,15.45 18.34,15.45 | 18.34,15.45 18.41,15.45 | 18.41,15.45 29.99,15.45 | S1.3 29.82,12.64 29.82,15.29 29.99,15.45 | JP1.1 36.04,29.11 33.72,26.79 33.72,19.18 29.99,15.45 | 56.39,56.74 59.7,56.74 | 59.7,56.74 60.98,58.03 60.96,58.05 U5.5 | 56.39,56.74 57.47,57.82 57.47,62.13 v57.41,62.19 | v60.32,67.25 60.32,71.1 60.34,71.12 | 22.01,21.76 22,21.77 C7.2 | R37.1 20.99,30.4 | R36.1 22.03,22.89 22.01,22.91
  Bottom 0.508: v57.41,62.19 57.41,64.34 v60.32,67.25
VLOAD_EXT
  Top 1.016: J12.3 109.87,67.73 108.45,66.31 108.45,63.11 107.88,62.54 J11.3 99.1,62.54 98.07,61.51 D6.1
VLOAD_INT
  Top 0.406: R17.2 107.74,48.13 108.39,48.13 111.64,44.88 114.65,44.88 117.64,47.87 117.64,49.56 R18.2
  Top 1.016: J2.1 117.54,43.21 108.51,43.21 107.05,44.67 R17.2
  Top 1.27: J2.1 J4.1 J6.1 J8.1 J10.1
VMOT_INT
  Top 0.305: R19.2 14.71,68.36 15.97,69.62 20.72,69.62 24.79,65.56 27.24,65.56 28.11,64.69 31.48,64.69
  Top 0.508: R19.2 15.33,66.81 17.65,66.81 R23.2
  pour Top (isolate 0.254): 31.2,65.65 31.2,63.35 31.2,63.35 38.07,63.35 38.51,63.79 38.51,65.48 38.05,65.94 35.84,65.94 34.67,64.77 34.07,64.77 33.19,65.65
VOLAD_EXT2
  Top 0.406: C43.1 110.11,52.94 109.64,52.47 106.73,52.47 106.73,52.72 R17.1
  Top 0.508: C5.2 C6.2 106.98,53.11 R17.1 106.94,53.15 | U4.5 111.27,51.36 C43.1 | D6.2 98.11,53.15
  Top 1.016: 106.94,53.15 98.11,53.15

### Text on the board
tNames: - | + | + | - | + | - | - | + | + | - | FW | FW | BW | BW | + | - | OUT | IN | POWER | GND | Current | R5 | + | 3v3 | R4 | - | RP_3v3 | R3 | R2 | DUT / ON/OFF | < | > | R1
bNames: Test Bench / v1-Jun23